# Altium schematic sheet A03_CURRENT_ADC.SchDoc: A03_CURRENT_ADC
size 420 x 296 mm; Revision: A-SCH-AD-R2-NO-TP; SheetNumber: 3; SheetTotal: 7
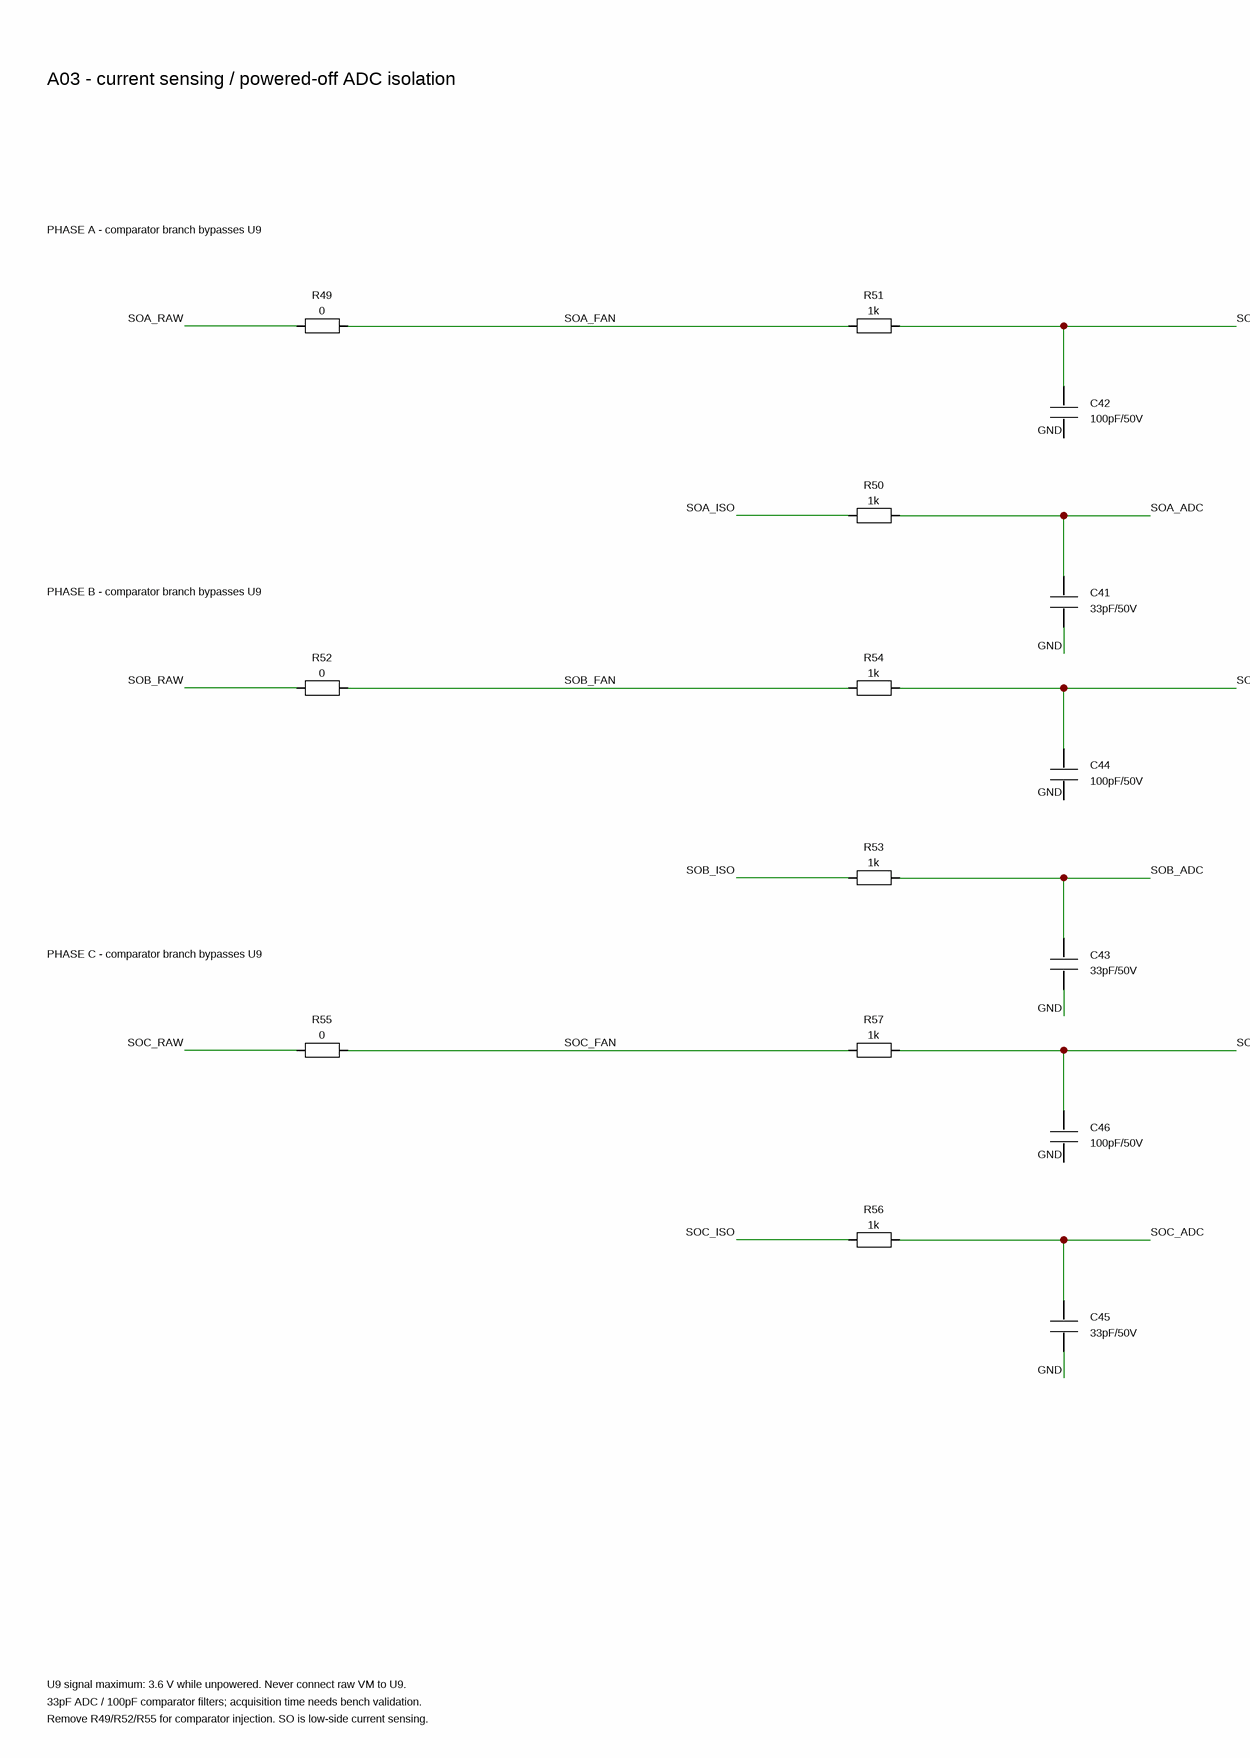
[diagram p0: A03_CURRENT_ADC.SchDoc, left]
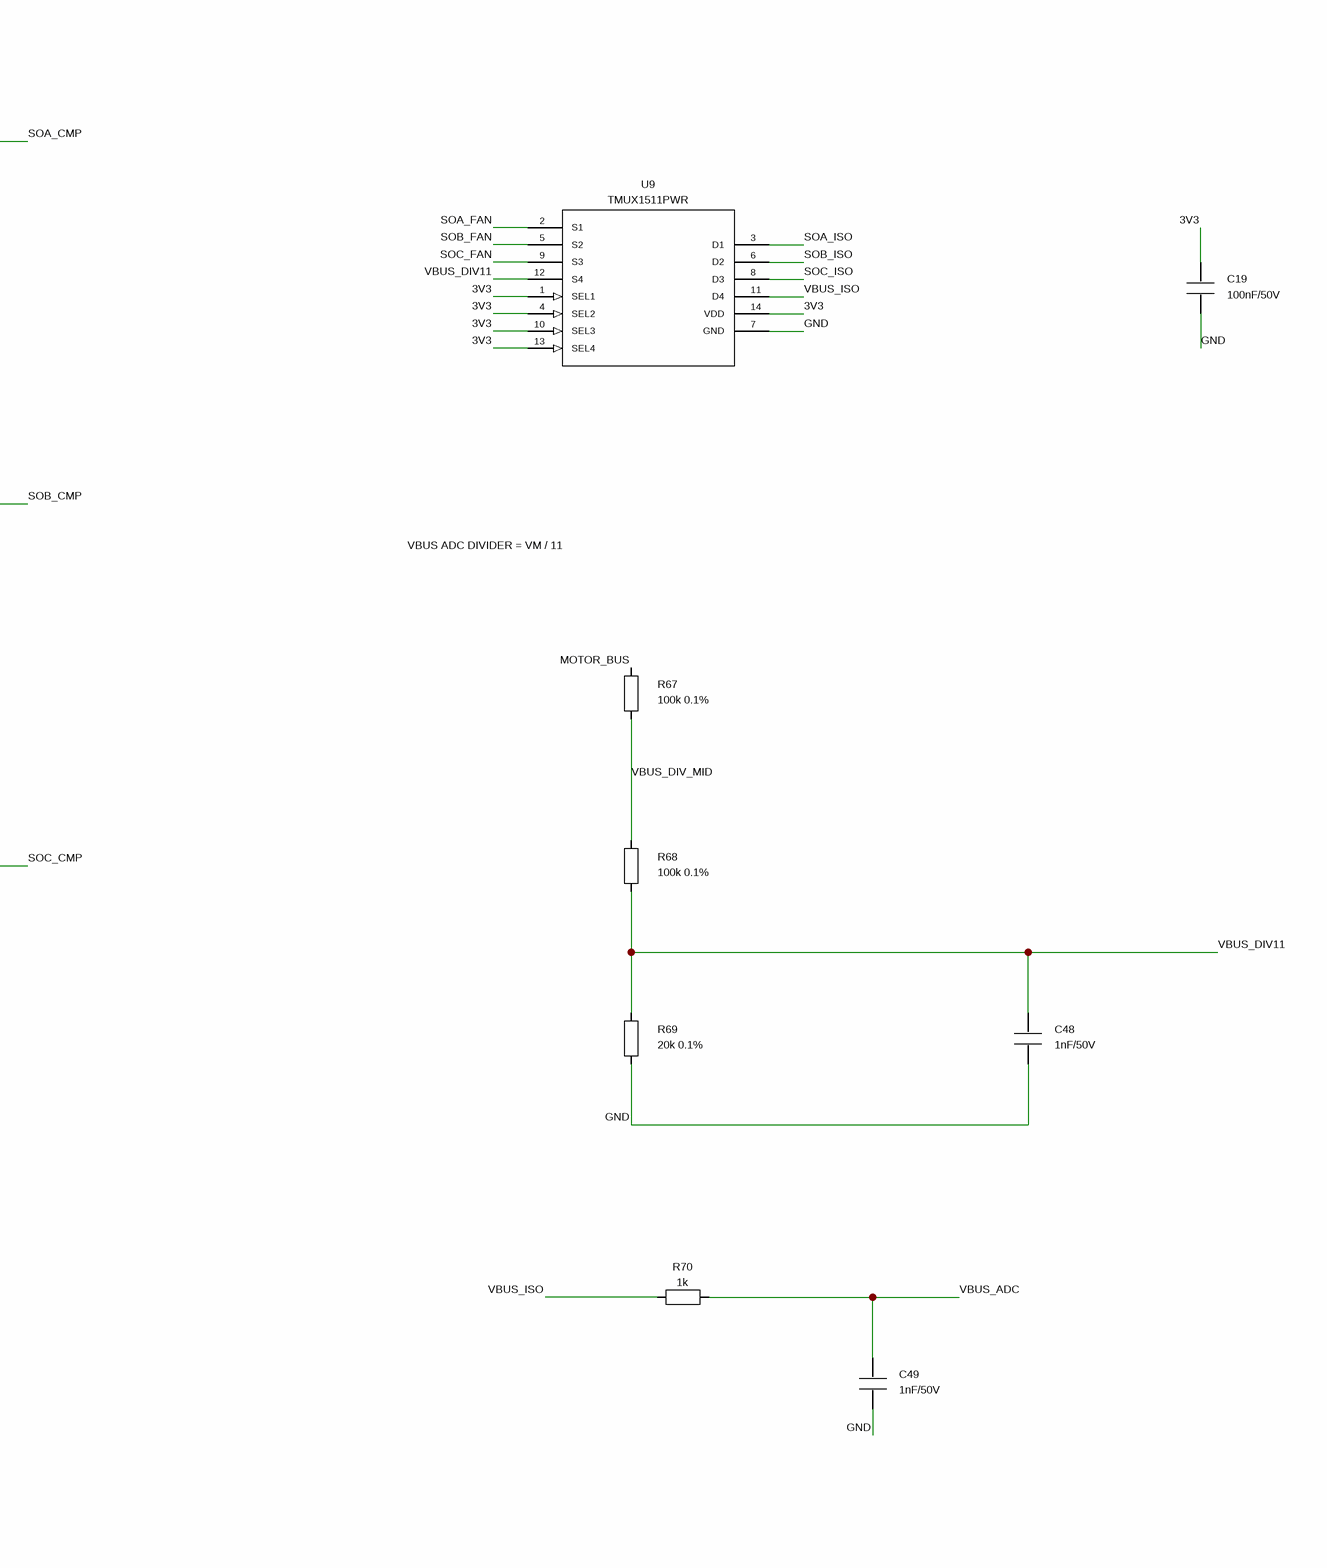
[diagram p1: A03_CURRENT_ADC.SchDoc, right]

## Parts
C19  100nF/50V  [C0603_M]
C41  33pF/50V  [C0603_M]
C42  100pF/50V  [C0603_M]
C43  33pF/50V  [C0603_M]
C44  100pF/50V  [C0603_M]
C45  33pF/50V  [C0603_M]
C46  100pF/50V  [C0603_M]
C48  1nF/50V  [C0603_M]
C49  1nF/50V  [C0603_M]
R49  0  [R0603_M]
R50  1k  [R0603_M]
R51  1k  [R0603_M]
R52  0  [R0603_M]
R53  1k  [R0603_M]
R54  1k  [R0603_M]
R55  0  [R0603_M]
R56  1k  [R0603_M]
R57  1k  [R0603_M]
R67  100k 0.1%  [R0603_M]
R68  100k 0.1%  [R0603_M]
R69  20k 0.1%  [R0603_M]
R70  1k  [R0603_M]
U9  TMUX1511PWR  [SOP65P640X120-14N]

## Nets
3V3: C19.1 U9.1(SEL1) U9.4(SEL2) U9.10(SEL3) U9.13(SEL4) U9.14(VDD)
GND: C19.2 C41.2 C42.2 C43.2 C44.2 C45.2 C46.2 C48.2 C49.2 R69.2 U9.7(GND)
MOTOR_BUS: R67.1
SOA_ADC: C41.1 R50.2
SOA_CMP: C42.1 R51.2
SOA_FAN: R49.2 R51.1 U9.2(S1)
SOA_ISO: R50.1 U9.3(D1)
SOA_RAW: R49.1
SOB_ADC: C43.1 R53.2
SOB_CMP: C44.1 R54.2
SOB_FAN: R52.2 R54.1 U9.5(S2)
SOB_ISO: R53.1 U9.6(D2)
SOB_RAW: R52.1
SOC_ADC: C45.1 R56.2
SOC_CMP: C46.1 R57.2
SOC_FAN: R55.2 R57.1 U9.9(S3)
SOC_ISO: R56.1 U9.8(D3)
SOC_RAW: R55.1
VBUS_ADC: C49.1 R70.2
VBUS_DIV11: C48.1 R68.2 R69.1 U9.12(S4)
VBUS_DIV_MID: R67.2 R68.1
VBUS_ISO: R70.1 U9.11(D4)

## Notes on the sheet
- A03 - current sensing / powered-off ADC isolation
- PHASE A - comparator branch bypasses U9
- PHASE B - comparator branch bypasses U9
- VBUS ADC DIVIDER = VM / 11
- PHASE C - comparator branch bypasses U9
- U9 signal maximum: 3.6 V while unpowered. Never connect raw VM to U9.
- 33pF ADC / 100pF comparator filters; acquisition time needs bench validation.
- Remove R49/R52/R55 for comparator injection. SO is low-side current sensing.

## Library data of the parts
C19 = C: 电容; MPN: CL10B104KB8NNNC; Source_KiCad_Footprint: GL30:C_0603_1608Metric; Specification: 100 nF / 50 V X7R; Design_note: U9.14; Assembly: FITTED; PCB_Model_Status: USER_LIBRARY_LINKED_PIN_NUMBERS_CHECKED; Package: 0603; Footprint_status: LIBRARY_SELECTED_PENDING_LAYOUT_REVIEW; Value: 100nF/50V
C41 C43 C45 = C: 电容; MPN: CC0603JRNPO9BN330; Source_KiCad_Footprint: GL30:C_0603_1608Metric; Specification: 33 pF / 50 V C0G ±5%; Assembly: FITTED; PCB_Model_Status: USER_LIBRARY_LINKED_PIN_NUMBERS_CHECKED; Package: 0603; Footprint_status: LIBRARY_SELECTED_PENDING_LAYOUT_REVIEW; Value: 33pF/50V
C42 C44 C46 = C: 电容; MPN: CC0603JRNPO9BN101; Source_KiCad_Footprint: GL30:C_0603_1608Metric; Specification: 100 pF / 50 V C0G ±5%; Assembly: FITTED; PCB_Model_Status: USER_LIBRARY_LINKED_PIN_NUMBERS_CHECKED; Package: 0603; Footprint_status: LIBRARY_SELECTED_PENDING_LAYOUT_REVIEW; Value: 100pF/50V
C48 C49 = C: 电容; MPN: CL10B102KB8NNNC; Source_KiCad_Footprint: GL30:C_0603_1608Metric; Specification: 1 nF / 50 V X7R; Assembly: FITTED; PCB_Model_Status: USER_LIBRARY_LINKED_PIN_NUMBERS_CHECKED; Package: 0603; Footprint_status: LIBRARY_SELECTED_PENDING_LAYOUT_REVIEW; Value: 1nF/50V
R49 R52 R55 = R: 电阻; MPN: 通用0Ω跳线 0.1 W; Source_KiCad_Footprint: GL30:R_0603_1608Metric; Specification: 0 Ω跳线；0.1 W; Design_note: 注入校验前拆开；禁止外部源顶入DRV输出; Assembly: FITTED; PCB_Model_Status: USER_LIBRARY_LINKED_PIN_NUMBERS_CHECKED; Package: 0603; Footprint_status: LIBRARY_SELECTED_PENDING_LAYOUT_REVIEW; Value: 0
R50 R51 R53 R54 R56 R57 R70 = R: 电阻; MPN: 通用厚膜 1k 1% 0.1 W; Source_KiCad_Footprint: GL30:R_0603_1608Metric; Specification: 1k Ω；1%；0.1 W; Assembly: FITTED; PCB_Model_Status: USER_LIBRARY_LINKED_PIN_NUMBERS_CHECKED; Package: 0603; Footprint_status: LIBRARY_SELECTED_PENDING_LAYOUT_REVIEW; Value: 1k
R67 R68 = R: 电阻; MPN: RT0603BRD07100KL; Source_KiCad_Footprint: GL30:R_0603_1608Metric; Specification: 100k Ω；0.1%；0.1 W; Assembly: FITTED; PCB_Model_Status: USER_LIBRARY_LINKED_PIN_NUMBERS_CHECKED; Package: 0603; Footprint_status: LIBRARY_SELECTED_PENDING_LAYOUT_REVIEW; Value: 100k 0.1%
R69 = R: 电阻; MPN: TNPW060320K0BEEA; Source_KiCad_Footprint: GL30:R_0603_1608Metric; Specification: 20k Ω；0.1%；0.1 W; Assembly: FITTED; PCB_Model_Status: USER_LIBRARY_LINKED_PIN_NUMBERS_CHECKED; Package: 0603; Footprint_status: LIBRARY_SELECTED_PENDING_LAYOUT_REVIEW; Value: 20k 0.1%
U9 = TMUX1511PWR: 四路采样断电隔离; Source_KiCad_Footprint: GL30:TSSOP-14_4.4x5mm_P0.65mm; Design_note: 4路SEL均接3V3；断电保护信号≤3.6V；保持比较器支路直连; Assembly: FITTED; PCB_Model_Status: USER_LIBRARY_LINKED_PIN_NUMBERS_CHECKED; Datasheet: https://www.ti.com/lit/ds/symlink/tmux1511.pdf; MPN: TMUX1511PWR; Package: PW TSSOP14 5×4.4 mm; Specification: TMUX1511PWR; Footprint_status: LIBRARY_SELECTED_PENDING_LAYOUT_REVIEW; Value: TMUX1511PWR